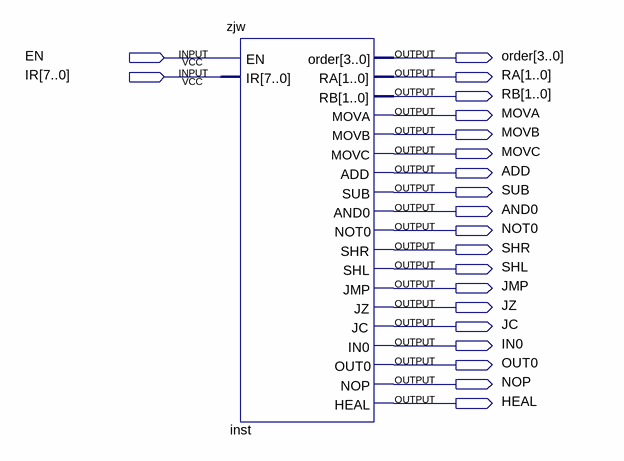
[diagram p0: schematic sheet]
// Quartus schematic Block1.bdf as structural Verilog: 1 symbols, 21 pins
module Block1 (
  input  EN,
  input  [7:0] IR,
  output [3:0] order,
  output [1:0] RA,
  output [1:0] RB,
  output MOVA,
  output MOVB,
  output MOVC,
  output ADD,
  output SUB,
  output AND0,
  output NOT0,
  output SHR,
  output SHL,
  output JMP,
  output JZ,
  output JC,
  output IN0,
  output OUT0,
  output NOP,
  output HEAL
);

  zjw inst (
    .EN(EN), .IR(IR), .order(order), .RA(RA), .RB(RB), .MOVA(MOVA), .MOVB(MOVB), .MOVC(MOVC), .ADD(ADD),
    .SUB(SUB), .AND0(AND0), .NOT0(NOT0), .SHR(SHR), .SHL(SHL), .JMP(JMP), .JZ(JZ), .JC(JC), .IN0(IN0),
    .OUT0(OUT0), .NOP(NOP), .HEAL(HEAL));
endmodule
